# EAGLE schematic board_TP4056 (EAGLE 9.5.2)
CNAME: Fume Extractor PCB; CREVISION: 1.0; DESIGNER: Kihun Song

## Sheet 1 of 2
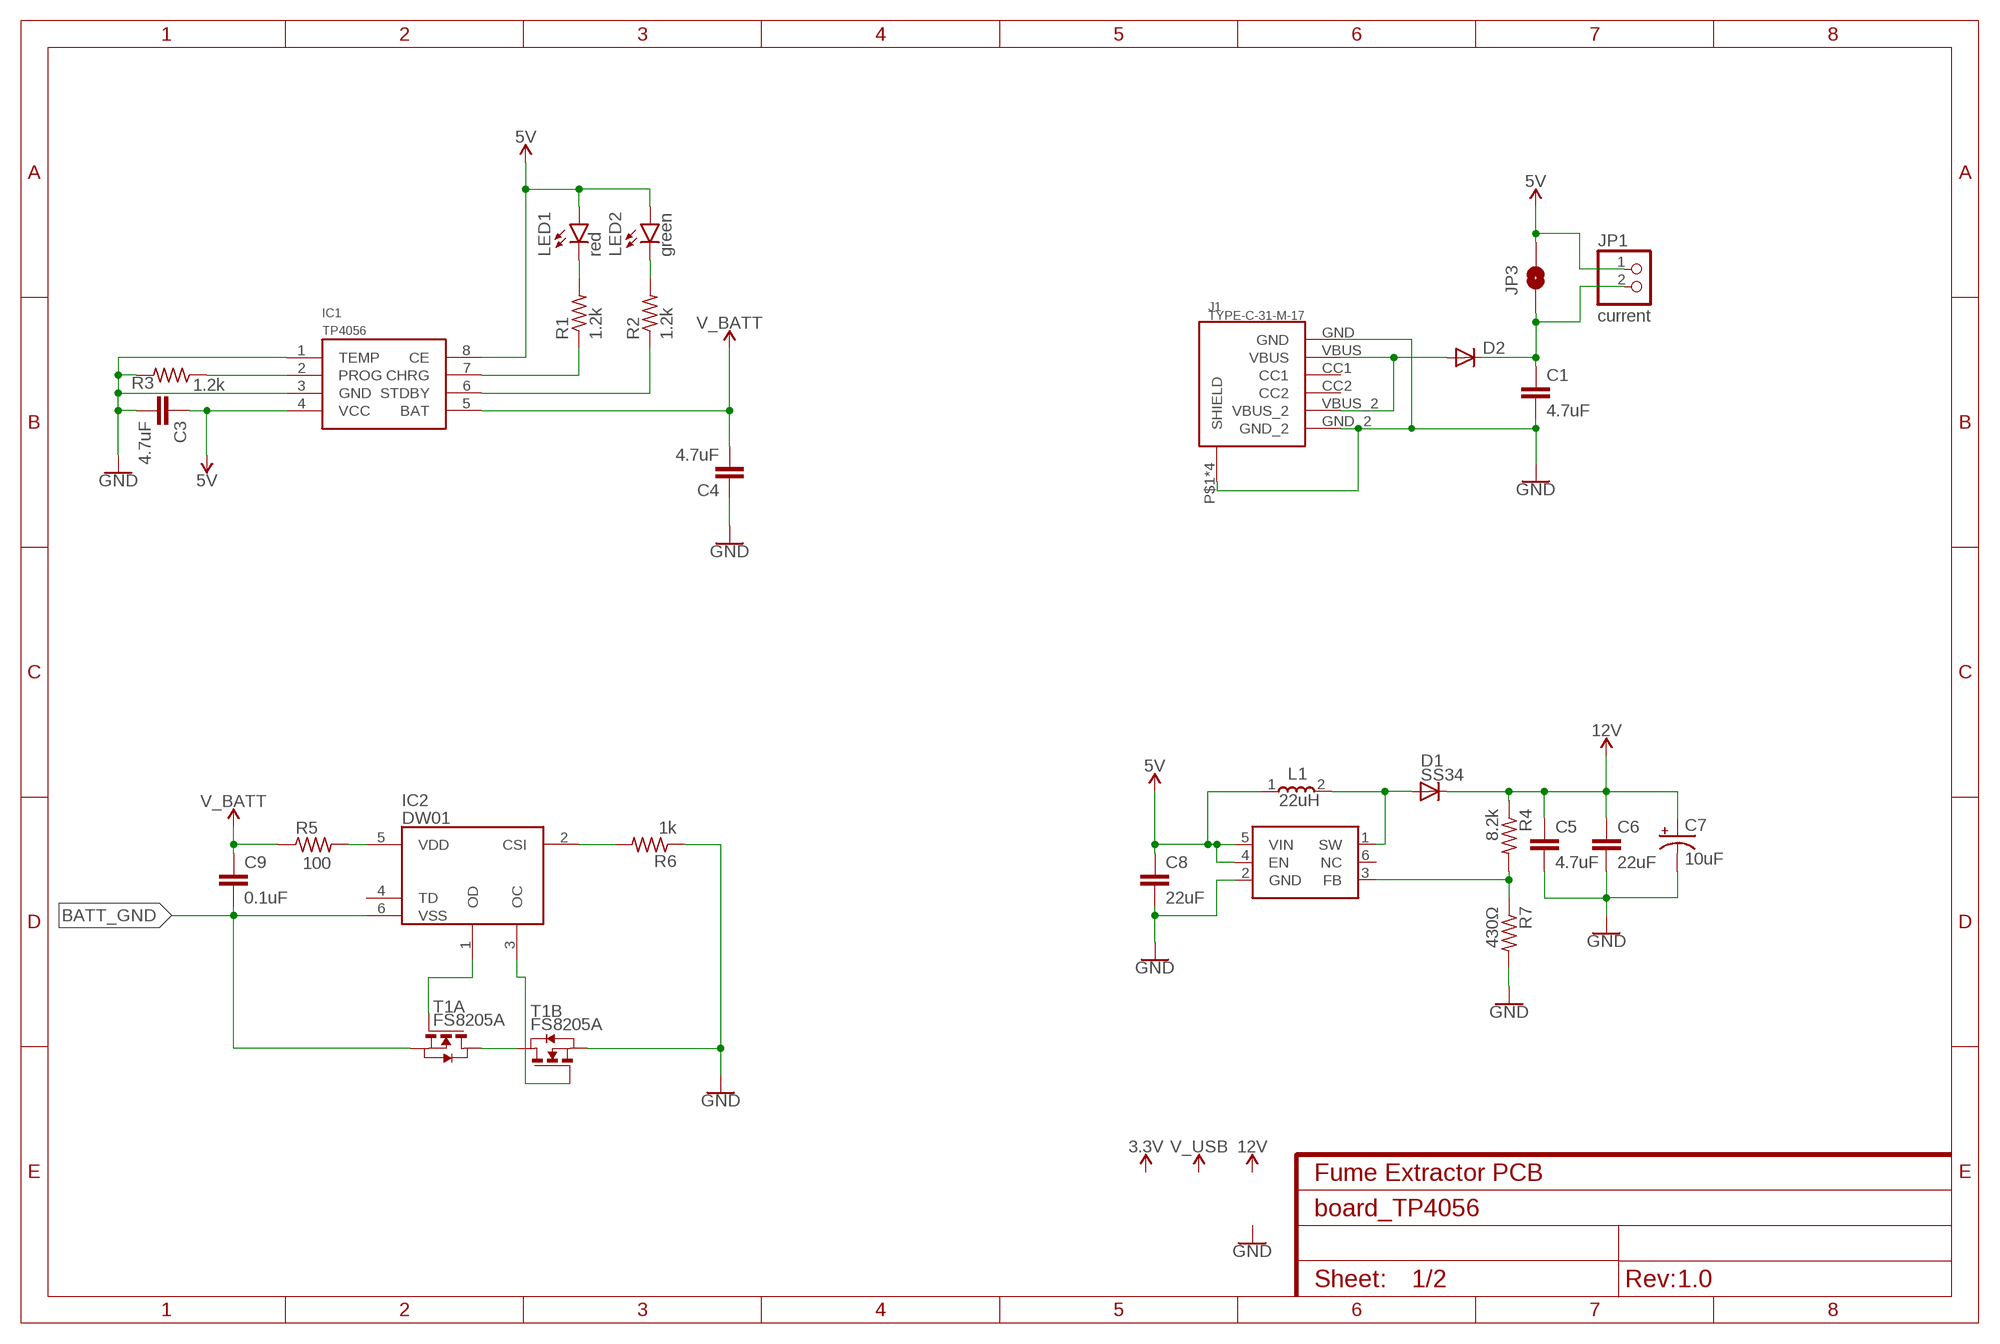
[diagram p0: schematic, sheet 1]

### Parts
C1  4.7uF  C-EUC0805  [C0805]
C3  4.7uF  C-EUC0805  [C0805]
C4  4.7uF  C-EUC0805  [C0805]
C5  4.7uF  C-EUC0805  [C0805]
C6  22uF  C-EUC0805  [C0805]
C7  10uF  CPOL-USSMCA  [SMC_A]
C8  22uF  C-EUC0805  [C0805]
C9  0.1uF  C-EUC0805  [C0805]
D1  SS34  DIODE-DO214AC  [DO214AC]
D2  DIODE-SOD-123  [SOD-123]
IC1  TP4056  [SOP-8]
IC2  DW01  [SOT95P280X135-6N]
J1  TYPE-C-31-M-17  [TYPE-C-31-M-17]
JP1  current  PINHD-1X2/OCT  [1X02/OCT]
JP3  JUMPER-SMT_2_NO_NO-SILK  [SMT-JUMPER_2_NO_NO-SILK]
L1  22uH  BCIHP0730-220M  [INDPM7066X300N]
LED1  red  LEDCHIP-LED0805  [CHIP-LED0805]
LED2  green  LEDCHIP-LED0805  [CHIP-LED0805]
R1  1.2k  R-US_R0805  [R0805]
R2  1.2k  R-US_R0805  [R0805]
R3  1.2k  R-US_R0805  [R0805]
R4  8.2k  R-US_R0805  [R0805]
R5  100  R-US_R0805  [R0805]
R6  1k  R-US_R0805  [R0805]
R7  430Ω  R-US_R0805  [R0805]
T1  FS8205A  FS8205A-MOSFET  [TSSOP-8]
U1  MT3608  [SOT23-6]

### Nets
5V [power]: C3.1 C8.1 IC1.4(VCC) IC1.8(CE) JP1.1 JP3.2 L1.1 LED1.A LED2.A U1.4(EN) U1.5(VIN)
12V [power]: C5.1 C6.1 C7.+ D1.C R4.1
BATT_GND [power]: C9.2 IC2.6(VSS) T1.2(A:S) T1.3(A:S)
GND [power]: C1.2 C3.2 C4.1 C5.2 C6.2 C7.- C8.2 IC1.1(TEMP) IC1.3(GND) J1.GND J1.GND_2 J1.P$1(SHIELD) J1.P$2(SHIELD) J1.P$3(SHIELD) J1.P$4(SHIELD) R3.2 R6.1 R7.2 T1.6(B:S) T1.7(B:S) U1.2(GND)
N$1 [power]: IC2.5(VDD) R5.2
N$2: IC1.7(CHRG) R1.1
N$3: IC1.6(STDBY) R2.1
N$4: IC2.2(CSI) R6.2
N$5 [power]: T1.1(A:D) T1.8(B:D)
N$6: IC2.1(OD) T1.4(A:G)
N$7: IC2.3(OC) T1.5(B:G)
N$8: IC1.2(PROG) R3.1
N$9: LED2.C R2.2
N$10 [power]: D1.A L1.2 U1.1(SW)
N$11: LED1.C R1.2
N$12: R4.2 R7.1 U1.3(FB)
N$13 [power]: C1.1 D2.C JP1.2 JP3.1
N$14 [power]: D2.A J1.VBUS J1.VBUS_2
V_BATT [power]: C4.2 C9.1 IC1.5(BAT) R5.1
Unconnected: IC2.4(TD) J1.CC1 J1.CC2 U1.6(NC)

## Sheet 2 of 2
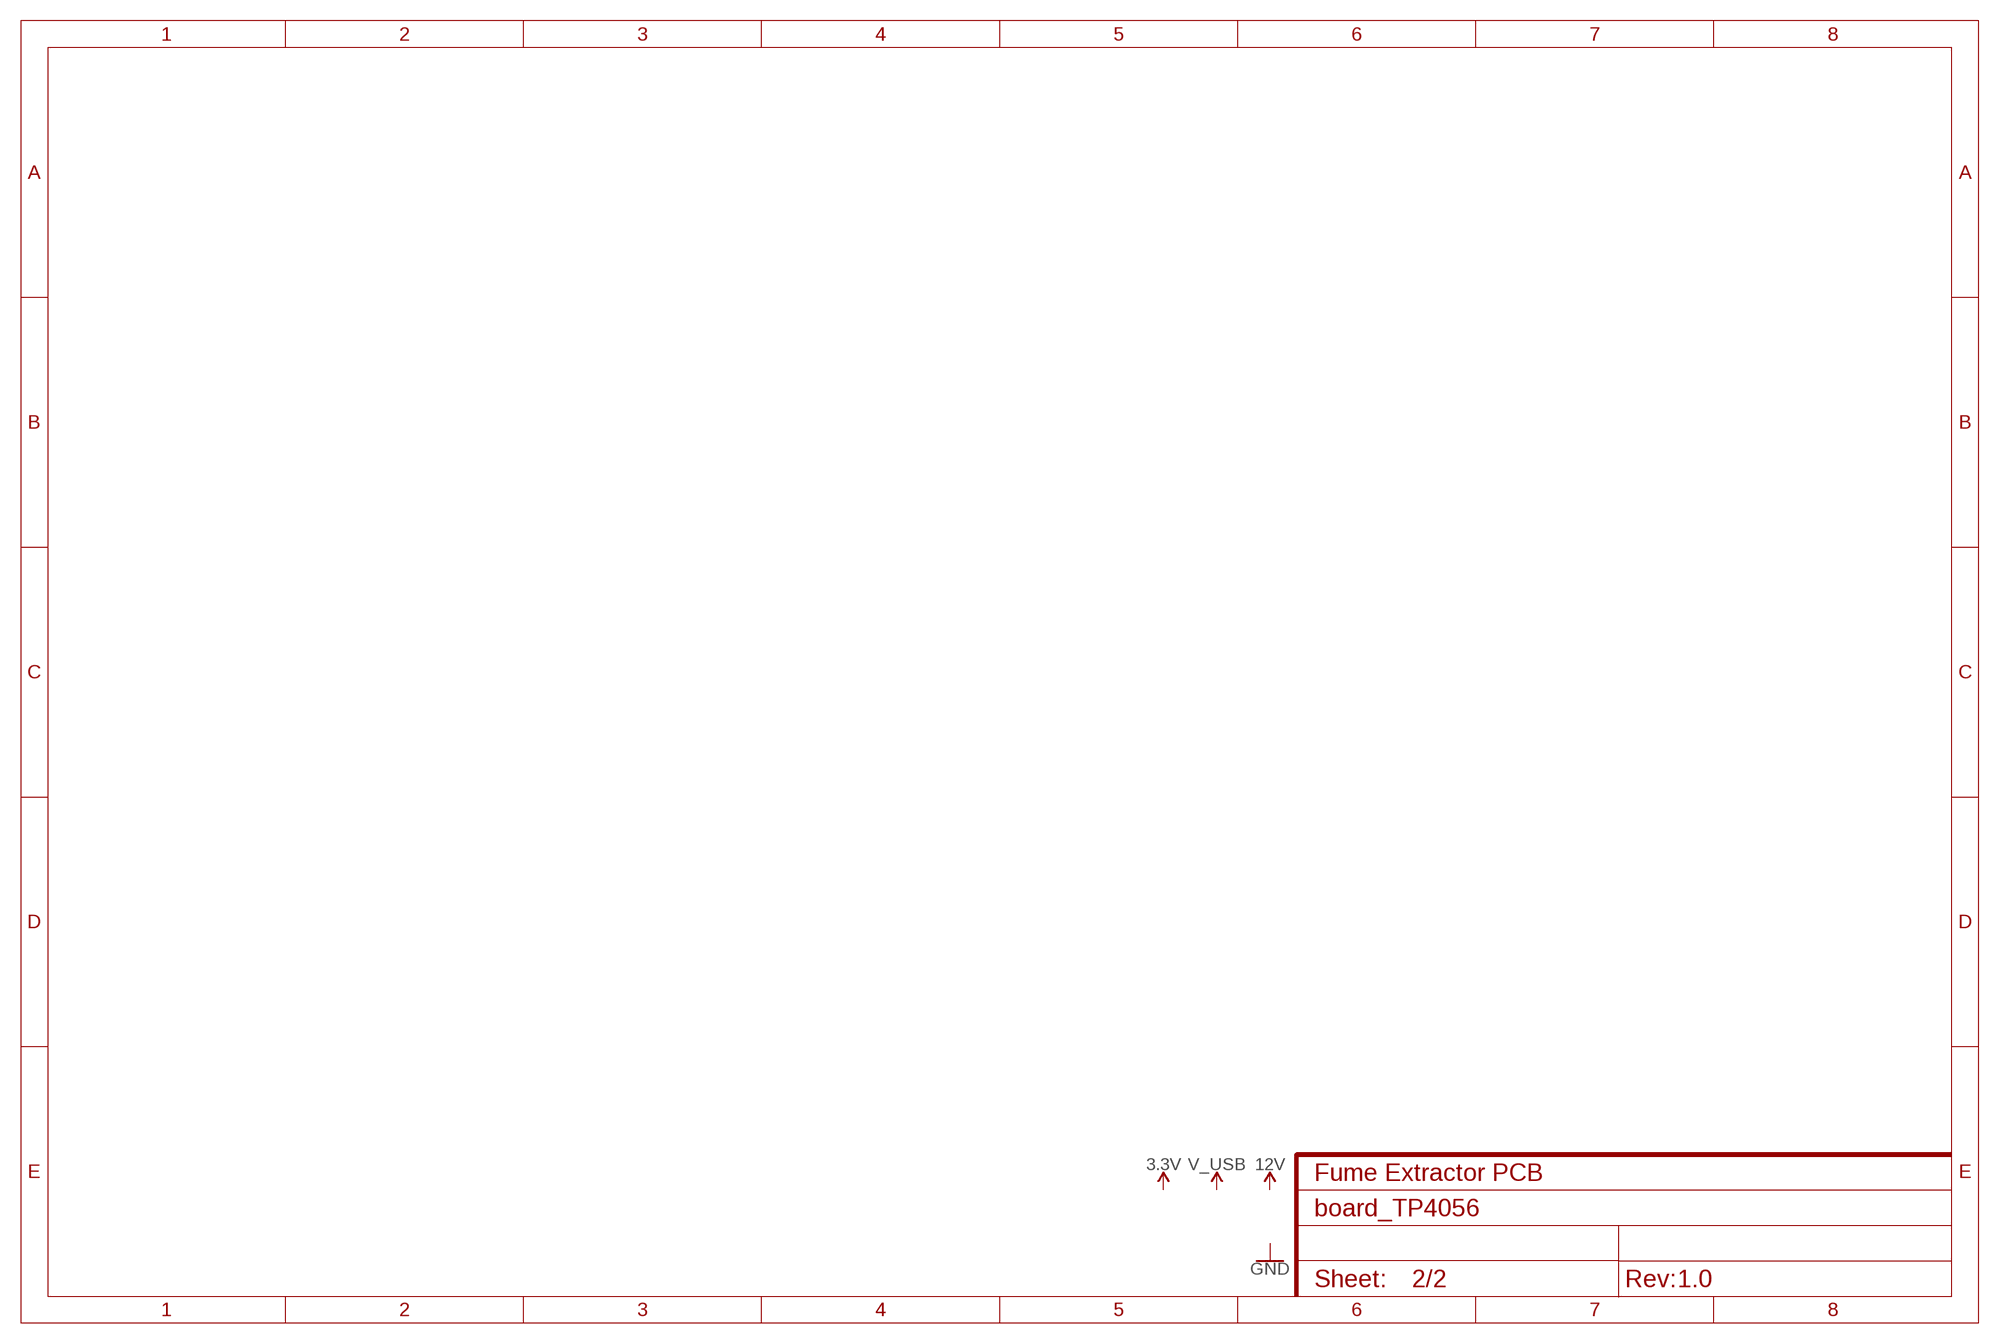
[diagram p1: schematic, sheet 2]

## Library data of the parts
C1 C3-C6 C8 C9 = rcl:C-EU: CAPACITOR, European symbol; SPICEPREFIX: C
C7 = rcl:CPOL-US: POLARIZED CAPACITOR, American symbol; SPICEPREFIX: C
D1 = diode:DIODE-: DIODE
D2 = dp_devices:DIODE: Various Diode Packages
IC1 = TP4056:TP4056
IC2 = DW01:DW01: ic Source: Datasheet <https://datasheet.lcsc.com/szlcsc/1906271838_SLKORMICRO-Elec-DW01_C359989.pdf>; DESCRIPTION: ic; HEIGHT: 1.35mm; MANUFACTURER_NAME: Slkor; MANUFACTURER_PART_NUMBER: DW01
J1 = Type-C_Hroparts:TYPE-C-31-M-17
JP1 = pinhead_v2:PINHD-1X2: PIN HEADER
JP3 = SparkFun-Jumpers:JUMPER-SMT_2_NO: Normally open jumper This jumper has two pads in close proximity to each other. Apply solder to close the connection. Round pads are easier to solder for beginners, but are a lot larger. SparkFun Product that uses the round pads: SparkFun EL Sequencer <https://www.sparkfun.com/products/12781>
L1 = BCIHP0730-220M:BCIHP0730-220M: Inductors (SMD) SMD,7x7x3mm RoHS Source: Datasheet <https://datasheet.lcsc.com/szlcsc/Bao-Cheng-Elec-BC-BCIHP0730-220M_C237916.pdf>; DESCRIPTION: Inductors (SMD) SMD,7x7x3mm RoHS; HEIGHT: 3mm; MANUFACTURER_NAME: Bao Cheng Elec; MANUFACTURER_PART_NUMBER: BCIHP0730-220M
LED1 LED2 = led:LED: LED OSRAM: - CHIPLED LG R971, LG N971, LY N971, LG Q971, LY Q971, LO R971, LY R971 LH N974, LH R974 LS Q976, LO Q976, LY Q976 LO Q996 - Hyper CHIPLED LW Q18S LB Q993, LB Q99A, LB R99A - SideLED LS A670, LO A670, LY A670, LG A670, LP A670 LB A673, LV A673, LT A673, LW A673 LH A674 LY A675 LS A676, LA A676, LO A676, LY A676, LW A676 LS A679, LY A679, LG A679 - Hyper Micro SIDELED® LS Y876, LA Y876, LO Y876, LY Y876 LT Y87S - SmartLED LW L88C, LW L88S LB L89C, LB L89S, LG L890 LS L89K, LO L89K, LY L89K LS L896, LA L896, LO L896, LY L896 - TOPLED LS T670, LO T670, LY T670, LG T670, LP T670 LSG T670, LSP T670, LSY T670, LOP T670, LYG T670 LG T671, LOG T671, LSG T671 LB T673, LV T673, LT T673, LW T673 LH T674 LS T676, LA T676, LO T676, LY T676, LB T676, LH T676, LSB T676, LW T676 LB T67C, LV T67C, LT T67C, LS T67K, LO T67K, LY T67K, LW E67C LS E67B, LA E67B, LO E67B, LY E67B, LB E67C, LV E67C, LT E67C LW T67C LS T679, LY T679, LG T679 LS T770, LO T770, LY T770, LG T770, LP T770 LB T773, LV T773, LT T773, LW T773 LH T774 LS E675, LA E675, LY E675, LS T675 LS T776, LA T776, LO T776, LY T776, LB T776 LHGB T686 LT T68C, LB T68C - Hyper Mini TOPLED® LB M676 - Mini TOPLED Santana® LG M470 LS M47K, LO M47K, LY M47K Source: http://www.osram.convergy.de LUXEON: - LUMILED® LXK2-PW12-R00, LXK2-PW12-S00, LXK2-PW14-U00, LXK2-PW14-V00 LXK2-PM12-R00, LXK2-PM12-S00, LXK2-PM14-U00 LXK2-PE12-Q00, LXK2-PE12-R00, LXK2-PE12-S00, LXK2-PE14-T00, LXK2-PE14-U00 LXK2-PB12-K00, LXK2-PB12-L00, LXK2-PB12-M00, LXK2-PB14-N00, LXK2-PB14-P00, LXK2-PB14-Q00 LXK2-PR12-L00, LXK2-PR12-M00, LXK2-PR14-Q00, LXK2-PR14-R00 LXK2-PD12-Q00, LXK2-PD12-R00, LXK2-PD12-S00 LXK2-PH12-R00, LXK2-PH12-S00 LXK2-PL12-P00, LXK2-PL12-Q00, LXK2-PL12-R00 Source: www.luxeon.com KINGBRIGHT: KA-3528ASYC Source: www.kingbright.com
R1-R7 = rcl:R-US_: RESISTOR, American symbol; SPICEPREFIX: R
T1 = FS8205A:FS8205A-MOSFET: DUAL N-CHANNEL ENHANCEMENT MODE MOSFET data sheet <http://goo.gl/dRgboR> Dave.Calaway Eagle Library <https://goo.gl/Muy1Tr>
U1 = buckboost:MT3608

## Net classes
0 default: width 0.203 mm
1 power: width 0.61 mm